# Altium schematic sheet Power Supply.SchDoc: LCL_GDI (DELUX)
size A4; Address1: ludzinc.blogspot.com.au; Address3: www.lowcostlabs.com.au; DocumentNumber: LCL_004; Revision: V2.00; SheetNumber: 2; SheetTotal: 8
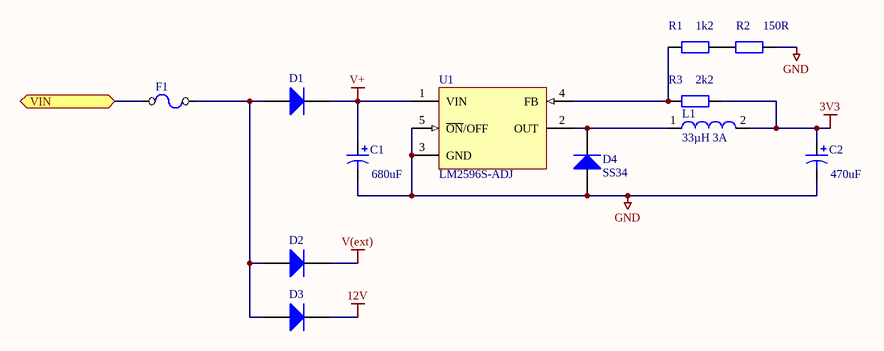
[diagram p0: Power Supply.SchDoc]

## Parts
C1  680uF  [PCB-jznsty645daf9i4vncxx-1]
C2  470uF  [PCB-jznsty645daf9i4vncxx-1]
D1  Vishay / Semiconductors S1MHE3/61T  [ONSC-SMA-2-403D-02_V]  (value not drawn)
D2  Vishay / Semiconductors S1MHE3/61T  [ONSC-SMA-2-403D-02_V]  (value not drawn)
D3  Vishay / Semiconductors S1MHE3/61T  [ONSC-SMA-2-403D-02_V]  (value not drawn)
D4  SS34  [PCB-16344855-1]
F1  1210L110/12WR  [PCB-8881447-1]  (value not drawn)
L1  33µH 3A  [WE-PD-L]
R1  1k2  [PCB-3652081-2]
R2  150R  [PCB-3652081-2]
R3  2k2  [PCB-3652081-2]
U1  LM2596S-ADJ  [TS5B_L]

## Ports
VIN

## Nets
3V3: C2.1 L1.2 R3.2
12V: D3.2(K)
GND: C1.2 C2.2 D4.1(A) R2.2 U1.3(GND) U1.5(~{ON}/OFF)
V(ext): D2.2(K)
V+: C1.1 D1.2(K) U1.1(VIN)
VIN: F1.1 ; port VIN
NetD1_1: D1.1(A) D2.1(A) D3.1(A) F1.2
NetD4_2: D4.2(K) L1.1 U1.2(OUT)
NetR1_1: R1.1 R3.1 U1.4(FB)
NetR1_2: R1.2 R2.1

## Notes on the sheet
- LOW COST LABS
- Title
- Size:
- Date:
- A4
- Number:
- Revision:
- Sheet
- of
- File:

## Library data of the parts
C1 C2 = CMP-jznsty645daf9i4vncxx-1: Capacitor Electrolytic E-Case (8mm Diameter); CustomComponentID: jznsty645daf9i4vncxx
D1-D3 = Vishay / Semiconductors S1MHE3/61T-4: DIODE GPP 1A 1000V SMA DO-214AC; Max Surge Current: 30 A; Recovery Time: 1800 ns; CiivaID: 3109060; Reverse Current IR: 5 uA; Configuration: Single; Forward Voltage Drop: 1.1 V; Packaging: Reel; Forward Continuous Current: 1 A; Manufacturer Part Number: S1MHE3/61T; Minimum Operating Temperature: - 55 C; Ciiva URL: https://ciiva.com/part/s1mhe3-61t-3109060; RoHS: Details; Manufacturer: Vishay; Mounting Style: SMD/SMT; Reverse Voltage: 1000 V; Product: Standard Recovery Rectifiers; Package / Case: SMA; Maximum Operating Temperature: + 150 C; Factory Pack Quantity: 1800; Product Category: Rectifiers
D4 = Fairchild Semiconductor SS34-2: DIODE SCHOTTKY 40V 3A SMC; Power Dissipation Limit-Max (W): 2.27; Configuration: SINGLE; Number of Phases: 1; Package Body Material: PLASTIC/EPOXY; JEDEC-95 Code: DO-214AB; Diode Element Material: SILICON; CiivaID: 16344855; CAGE Code: 1HBD3,07933,59621,7D893; Non-rep Pk Forward Current-Max (A): 100; Average Forward Current-Max (A): 3; Rep Pk Reverse Voltage-Max (V): 40; Rectifier Diode Type: RECTIFIER DIODE; Rectifier Diode Application: GENERAL PURPOSE; Terminal Finish: MATTE TIN; Package Style: SMALL OUTLINE; Terminal Form: C BEND; JESD-30 Code: R-PDSO-C2; Ciiva URL: https://ciiva.com/part/ss34-16344855; Surface Mount: YES; Manufacturer Part Number: SS34; Package Shape: RECTANGULAR; Technology: SCHOTTKY; Number of Elements: 1; Number of Terminals: 2; Moisture Sensitivity Level: 1; Peak Reflow Temperature (Cel): 260; JESD-97 Code: e3; Terminal Position: DUAL; RoHS Compliant: YES; Lead Free: YES
F1 = CMP-8881447-2: PTC 12V POLYFUSE SMT 1210 1.10A; Brand: Littelfuse; Manufacturer: Littelfuse; Product Category: Resettable Fuses - PPTC; CiivaID: 8881447; RoHS: Details; Manufacturer Part Number: 1210L110/12WR; Ciiva URL: https://ciiva.com/part/1210l110-12wr-8881447; Packaging: Reel; Factory Pack Quantity: 3000
L1 = CMP-pndpqninr9wk38ord9ee-1: SMD POWER INDUCTOR 12 x 12 mm; CustomComponentID: pndpqninr9wk38ord9ee
R1-R3 = CMP-rprrpiwz7au7w5x5ojb2-2: GENERIC 0805 RESISTOR; CustomComponentID: rprrpiwz7au7w5x5ojb2
U1 = LM2596S-ADJ-4: SIMPLE SWITCHER® Power Converter 150 KHz 3A Step-Down Voltage Regulator, 5-pin TO-263; Manufacturer: TI (Texas Instruments) / National Semiconductor; Output Voltage Max: 37V; No. of Outputs: 1; CiivaID: 2394759; Supply Voltage Max: 40V; SVHC: No SVHC (19-Dec-2012); Supply Voltage Min: 4.5V; Adjustable Output Voltage Min: 1.285V; Accuracy %: 4%; Frequency: 150kHz; Base Number: 2596; Input Voltage Min: 15V; No. of Pins: 5; Output Voltage Min: 1.23V; Voltage Regulator Type: Switching, Step Down (Buck), Inverting; Power Supply IC Type: Step-down switching regulator; Operating Temperature Max: 125Â°C; Operating Temperature Range: -40Â°C to +125Â°C; Package / Case: TO-263 (D2-Pak); Packaging: Tube; Voltage Regulator Case Style: TO-263; Output Current Max: 3A; Switch Output Current Isw Max: 3A; Termination Type: SMD; Ciiva URL: https://ciiva.com/part/lm2596s-adj-2394759; Output Current: 3A; Operating Temperature Min: -40Â°C; Input Voltage Max: 40V; Output Voltage: 37V; Primary Input Voltage: 40V; IC Generic Number: 2596